# EasyEDA schematic SCH_mylm317_2023-06-13.json
TITLE: Sheet_1; REV: 1.0; Date: 2023-01-27; Sheet: 1/1; Drawn By: bigjohnson; Company: Your Company
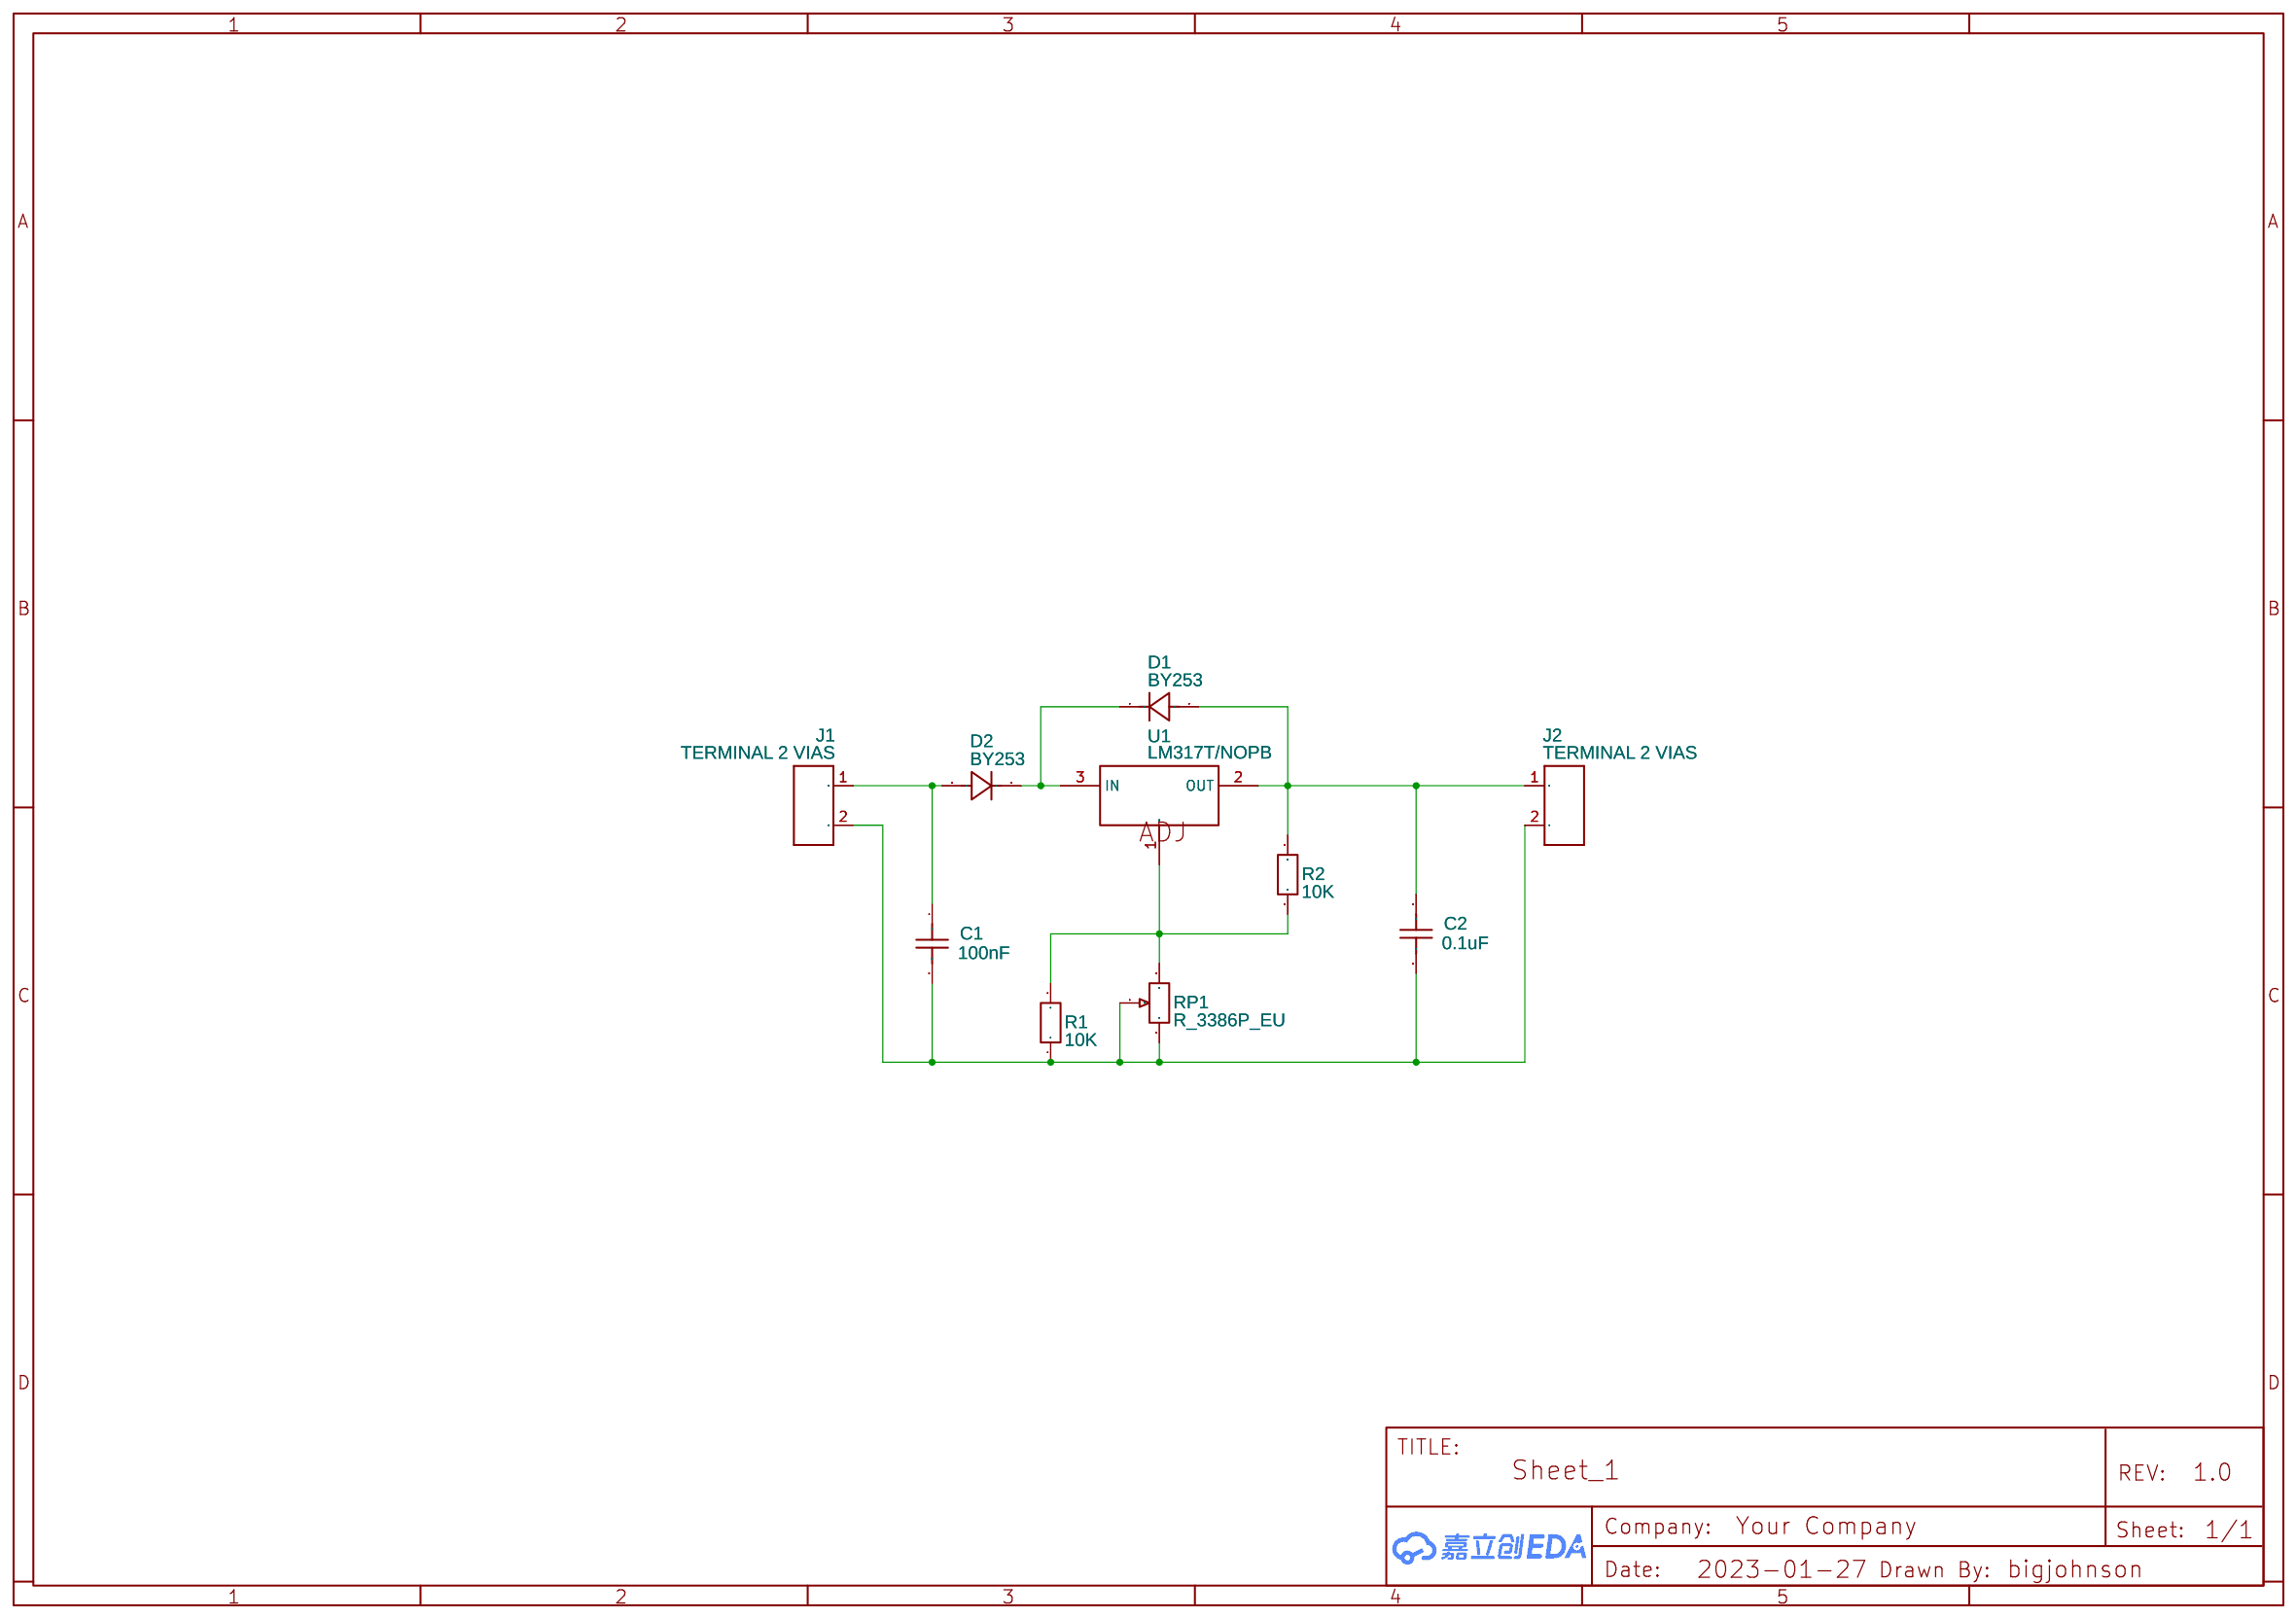
[diagram p0: schematic sheet]

## Parts
C1  100nF  [CAP-TH_L4.2-W3.8-P5.08-D0.6]
C2  0.1uF  [CAP-TH_L4.2-W3.8-P5.08-D0.6]
D1  BY253  [DO-201_BD5.1-L8.4-P15.24-D1.0-RD]
D2  BY253  [DO-201_BD5.1-L8.4-P15.24-D1.0-RD]
J1  TERMINAL 2 VIAS  [H2-5.0-10.5X8.0MM]
J2  TERMINAL 2 VIAS  [H2-5.0-10.5X8.0MM]
R1  10K  [AXIAL-0.4]
R2  10K  [AXIAL-0.4]
RP1  R_3386P_EU  [RES-ADJ-TH_3386P]
U1  LM317T/NOPB  [TO-220-3_L10.2-W4.6-P2.54-L]

## Library data of the parts
C1 C2 = CT4-0805B103 K500: Supplier: LCSC; Manufacturer: ReliaPro; Supplier Part: C8033
D1 D2 = MUR460_C2990844: Supplier: LCSC; Supplier Part: C2990844; Manufacturer: GOOD-ARK(固锝); Manufacturer Part: MUR460; JLCPCB Part Class: Extended Part; Contributor: lcsc
J1 J2 = TERMINAL 2 VIAS: DIP Blue Screw Terminal;; Manufacturer Part: GS009S-2P-2
R1 R2 = Res_AXIAL-0.4(1/4W)_EU
RP1 = R_3386P_EU: Supplier: LCSC; Contributor: LCEDA_Lib; Value(Ω): 10K
U1 = LM317T/NOPB: Supplier: LCSC; Supplier Part: C2870516; Manufacturer: TI(德州仪器); link: https://atta.szlcsc.comnull; Contributor: LCSC

## Nets
Net-(C1-1): C1.1 D2.2(A) J1.1
Net-(C1-2): C1.2 C2.2 J1.2 J2.2 R1.1 RP1.1 RP1.2
Net-(C2-1): C2.1 D1.2(A) J2.1 R2.2 U1.2(OUT)
Net-(D1-1): D1.1(K) D2.1(K) U1.3(IN)
Net-(R1-2): R1.2 R2.1 RP1.3 U1.1(ADJ)
